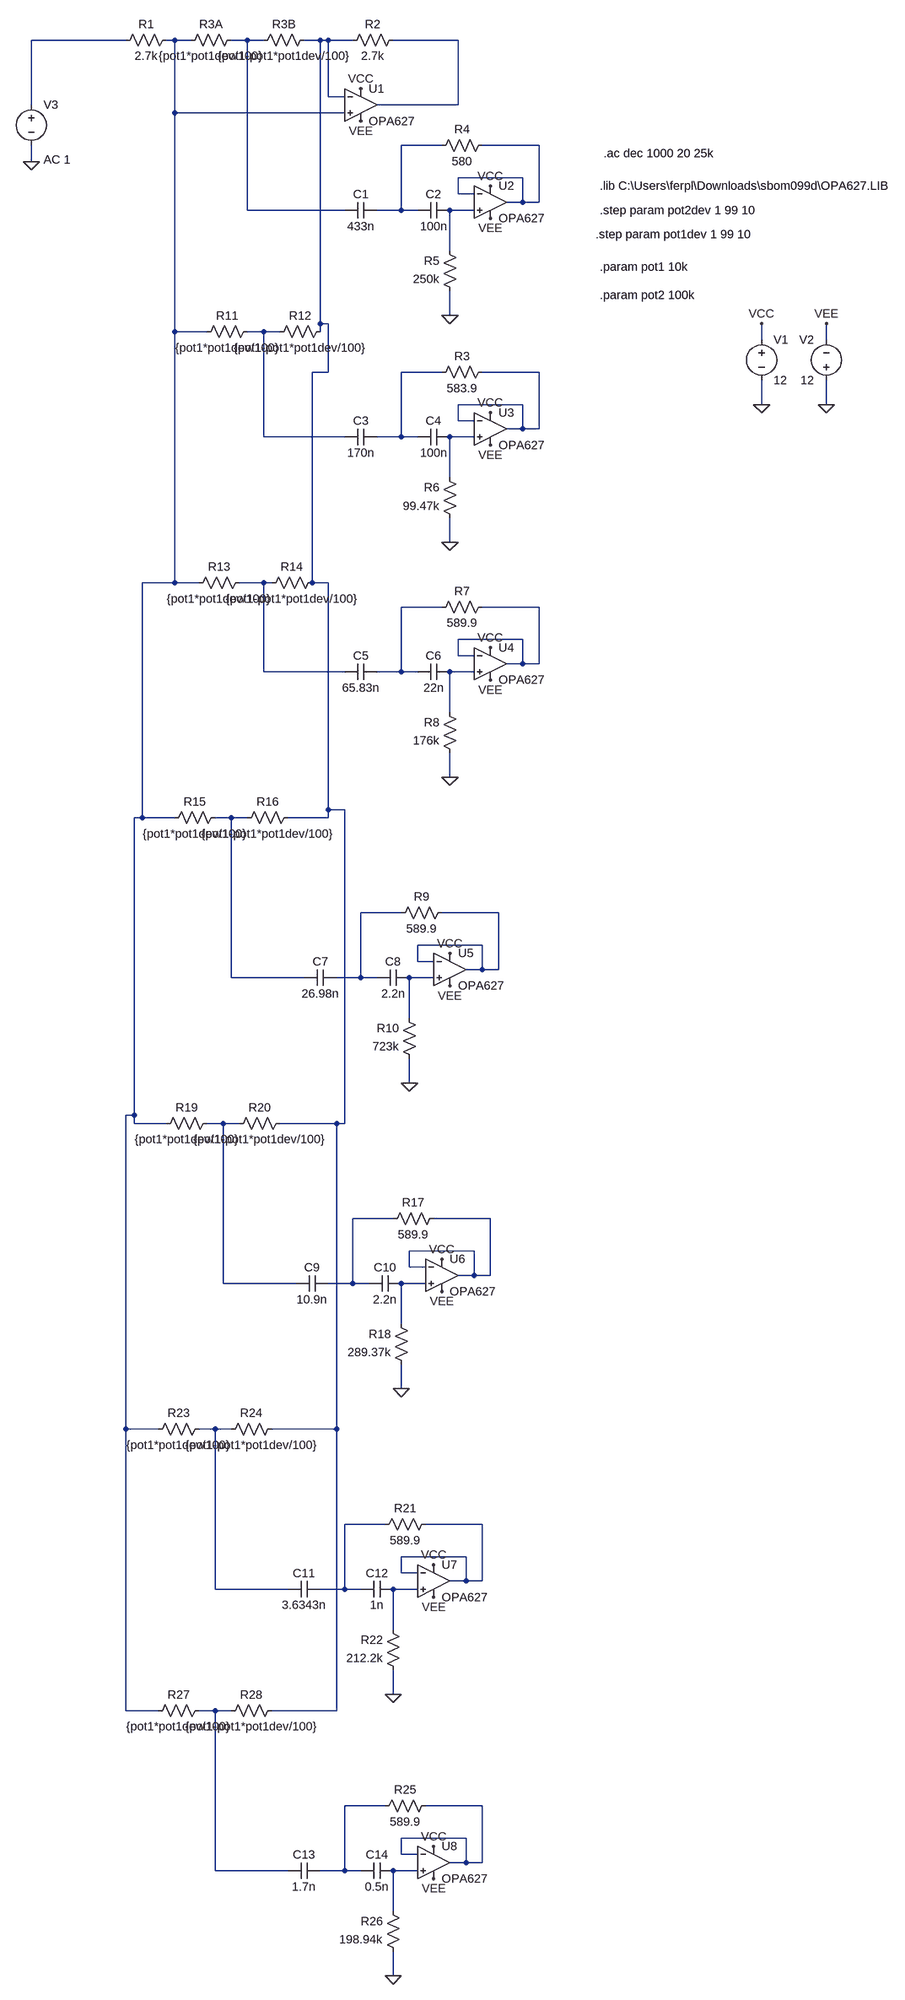
[diagram p0: schematic EQGraphic.asc]
EQGraphic.asc, the LTspice schematic file:
Version 4
SHEET 1 1188 3876
WIRE -832 -48 -1104 -48
WIRE -736 -48 -752 -48
WIRE -704 -48 -736 -48
WIRE -592 -48 -624 -48
WIRE -560 -48 -592 -48
WIRE -448 -48 -480 -48
WIRE -432 -48 -448 -48
WIRE -384 -48 -432 -48
WIRE -176 -48 -304 -48
WIRE -432 64 -432 -48
WIRE -400 64 -432 64
WIRE -1104 80 -1104 -48
WIRE -176 80 -176 -48
WIRE -176 80 -336 80
WIRE -736 96 -736 -48
WIRE -400 96 -736 96
WIRE -208 160 -288 160
WIRE -16 160 -128 160
WIRE -1104 192 -1104 160
WIRE -48 224 -176 224
WIRE -176 256 -176 224
WIRE -144 256 -176 256
WIRE -48 272 -48 224
WIRE -48 272 -80 272
WIRE -16 272 -16 160
WIRE -16 272 -48 272
WIRE -592 288 -592 -48
WIRE -400 288 -592 288
WIRE -288 288 -288 160
WIRE -288 288 -336 288
WIRE -256 288 -288 288
WIRE -144 288 -192 288
WIRE -192 368 -192 288
WIRE -192 496 -192 448
WIRE -448 512 -448 -48
WIRE -432 512 -448 512
WIRE -736 528 -736 96
WIRE -672 528 -736 528
WIRE -560 528 -592 528
WIRE -528 528 -560 528
WIRE -448 528 -448 512
WIRE 864 544 864 512
WIRE 992 544 992 512
WIRE -432 608 -432 512
WIRE -432 608 -464 608
WIRE -208 608 -288 608
WIRE -16 608 -128 608
WIRE -48 672 -176 672
WIRE 864 672 864 624
WIRE 992 672 992 624
WIRE -176 704 -176 672
WIRE -144 704 -176 704
WIRE -48 720 -48 672
WIRE -48 720 -80 720
WIRE -16 720 -16 608
WIRE -16 720 -48 720
WIRE -560 736 -560 528
WIRE -400 736 -560 736
WIRE -288 736 -288 608
WIRE -288 736 -336 736
WIRE -256 736 -288 736
WIRE -144 736 -192 736
WIRE -192 816 -192 736
WIRE -192 944 -192 896
WIRE -736 1024 -736 528
WIRE -736 1024 -800 1024
WIRE -688 1024 -736 1024
WIRE -560 1024 -608 1024
WIRE -544 1024 -560 1024
WIRE -464 1024 -464 608
WIRE -432 1024 -464 1024
WIRE -208 1072 -288 1072
WIRE -16 1072 -128 1072
WIRE -48 1136 -176 1136
WIRE -176 1168 -176 1136
WIRE -144 1168 -176 1168
WIRE -48 1184 -48 1136
WIRE -48 1184 -80 1184
WIRE -16 1184 -16 1072
WIRE -16 1184 -48 1184
WIRE -560 1200 -560 1024
WIRE -400 1200 -560 1200
WIRE -288 1200 -288 1072
WIRE -288 1200 -336 1200
WIRE -256 1200 -288 1200
WIRE -144 1200 -192 1200
WIRE -192 1280 -192 1200
WIRE -192 1408 -192 1360
WIRE -432 1472 -432 1024
WIRE -400 1472 -432 1472
WIRE -800 1488 -800 1024
WIRE -800 1488 -816 1488
WIRE -736 1488 -800 1488
WIRE -624 1488 -656 1488
WIRE -592 1488 -624 1488
WIRE -432 1488 -432 1472
WIRE -432 1488 -512 1488
WIRE -288 1696 -368 1696
WIRE -96 1696 -208 1696
WIRE -128 1760 -256 1760
WIRE -256 1792 -256 1760
WIRE -224 1792 -256 1792
WIRE -128 1808 -128 1760
WIRE -128 1808 -160 1808
WIRE -96 1808 -96 1696
WIRE -96 1808 -128 1808
WIRE -624 1824 -624 1488
WIRE -480 1824 -624 1824
WIRE -368 1824 -368 1696
WIRE -368 1824 -416 1824
WIRE -336 1824 -368 1824
WIRE -224 1824 -272 1824
WIRE -272 1904 -272 1824
WIRE -272 2032 -272 1984
WIRE -816 2096 -816 1488
WIRE -816 2096 -832 2096
WIRE -816 2112 -816 2096
WIRE -752 2112 -816 2112
WIRE -640 2112 -672 2112
WIRE -608 2112 -640 2112
WIRE -416 2112 -528 2112
WIRE -400 2112 -400 1472
WIRE -400 2112 -416 2112
WIRE -304 2320 -384 2320
WIRE -112 2320 -224 2320
WIRE -144 2384 -272 2384
WIRE -272 2416 -272 2384
WIRE -240 2416 -272 2416
WIRE -144 2432 -144 2384
WIRE -144 2432 -176 2432
WIRE -112 2432 -112 2320
WIRE -112 2432 -144 2432
WIRE -640 2448 -640 2112
WIRE -496 2448 -640 2448
WIRE -384 2448 -384 2320
WIRE -384 2448 -432 2448
WIRE -352 2448 -384 2448
WIRE -240 2448 -288 2448
WIRE -288 2528 -288 2448
WIRE -288 2656 -288 2608
WIRE -832 2736 -832 2096
WIRE -768 2736 -832 2736
WIRE -656 2736 -688 2736
WIRE -624 2736 -656 2736
WIRE -416 2736 -416 2112
WIRE -416 2736 -544 2736
WIRE -320 2944 -400 2944
WIRE -128 2944 -240 2944
WIRE -160 3008 -288 3008
WIRE -288 3040 -288 3008
WIRE -256 3040 -288 3040
WIRE -160 3056 -160 3008
WIRE -160 3056 -192 3056
WIRE -128 3056 -128 2944
WIRE -128 3056 -160 3056
WIRE -656 3072 -656 2736
WIRE -512 3072 -656 3072
WIRE -400 3072 -400 2944
WIRE -400 3072 -448 3072
WIRE -368 3072 -400 3072
WIRE -256 3072 -304 3072
WIRE -304 3152 -304 3072
WIRE -304 3280 -304 3232
WIRE -832 3312 -832 2736
WIRE -768 3312 -832 3312
WIRE -656 3312 -688 3312
WIRE -624 3312 -656 3312
WIRE -416 3312 -416 2736
WIRE -416 3312 -544 3312
WIRE -320 3520 -400 3520
WIRE -128 3520 -240 3520
WIRE -160 3584 -288 3584
WIRE -288 3616 -288 3584
WIRE -256 3616 -288 3616
WIRE -160 3632 -160 3584
WIRE -160 3632 -192 3632
WIRE -128 3632 -128 3520
WIRE -128 3632 -160 3632
WIRE -656 3648 -656 3312
WIRE -512 3648 -656 3648
WIRE -400 3648 -400 3520
WIRE -400 3648 -448 3648
WIRE -368 3648 -400 3648
WIRE -256 3648 -304 3648
WIRE -304 3728 -304 3648
WIRE -304 3856 -304 3808
FLAG 864 672 0
FLAG 992 672 0
FLAG 864 512 VCC
FLAG 992 512 VEE
FLAG -368 48 VCC
FLAG -368 112 VEE
FLAG -1104 192 0
FLAG -112 240 VCC
FLAG -112 304 VEE
FLAG -112 688 VCC
FLAG -112 752 VEE
FLAG -112 1152 VCC
FLAG -112 1216 VEE
FLAG -192 1408 0
FLAG -192 1776 VCC
FLAG -192 1840 VEE
FLAG -272 2032 0
FLAG -192 944 0
FLAG -192 496 0
FLAG -208 2400 VCC
FLAG -208 2464 VEE
FLAG -288 2656 0
FLAG -224 3024 VCC
FLAG -224 3088 VEE
FLAG -304 3280 0
FLAG -224 3600 VCC
FLAG -224 3664 VEE
FLAG -304 3856 0
SYMBOL voltage 864 528 R0
WINDOW 123 0 0 Left 0
WINDOW 39 0 0 Left 0
SYMATTR InstName V1
SYMATTR Value 12
SYMBOL voltage 992 640 R180
WINDOW 0 24 96 Left 2
WINDOW 3 24 16 Left 2
WINDOW 123 0 0 Left 0
WINDOW 39 0 0 Left 0
SYMATTR InstName V2
SYMATTR Value 12
SYMBOL OpAmps\\opamp2 -368 16 R0
SYMATTR InstName U1
SYMATTR Value OPA627
SYMBOL res -736 -64 R90
WINDOW 0 0 56 VBottom 2
WINDOW 3 32 56 VTop 2
SYMATTR InstName R1
SYMATTR Value 2.7k
SYMBOL res -608 -64 R90
WINDOW 0 0 56 VBottom 2
WINDOW 3 32 56 VTop 2
SYMATTR InstName R3A
SYMATTR Value {pot1*pot1dev/100}
SYMBOL res -464 -64 R90
WINDOW 0 0 56 VBottom 2
WINDOW 3 32 56 VTop 2
SYMATTR InstName R3B
SYMATTR Value {pot1-pot1*pot1dev/100}
SYMBOL res -288 -64 R90
WINDOW 0 0 56 VBottom 2
WINDOW 3 32 56 VTop 2
SYMATTR InstName R2
SYMATTR Value 2.7k
SYMBOL voltage -1104 64 R0
WINDOW 123 24 124 Left 2
WINDOW 39 0 0 Left 0
SYMATTR InstName V3
SYMATTR Value ""
SYMATTR Value2 AC 1
SYMBOL OpAmps\\opamp2 -112 208 R0
SYMATTR InstName U2
SYMATTR Value OPA627
SYMBOL cap -336 272 R90
WINDOW 0 0 32 VBottom 2
WINDOW 3 32 32 VTop 2
SYMATTR InstName C1
SYMATTR Value 433n
SYMBOL res -112 144 R90
WINDOW 0 0 56 VBottom 2
WINDOW 3 32 56 VTop 2
SYMATTR InstName R4
SYMATTR Value 580
SYMBOL res -176 464 R180
WINDOW 0 36 76 Left 2
WINDOW 3 36 40 Left 2
SYMATTR InstName R5
SYMATTR Value 250k
SYMBOL cap -192 272 R90
WINDOW 0 0 32 VBottom 2
WINDOW 3 32 32 VTop 2
SYMATTR InstName C2
SYMATTR Value 100n
SYMBOL OpAmps\\opamp2 -112 656 R0
SYMATTR InstName U3
SYMATTR Value OPA627
SYMBOL cap -336 720 R90
WINDOW 0 0 32 VBottom 2
WINDOW 3 32 32 VTop 2
SYMATTR InstName C3
SYMATTR Value 170n
SYMBOL res -112 592 R90
WINDOW 0 0 56 VBottom 2
WINDOW 3 32 56 VTop 2
SYMATTR InstName R3
SYMATTR Value 583.9
SYMBOL res -176 912 R180
WINDOW 0 36 76 Left 2
WINDOW 3 36 40 Left 2
SYMATTR InstName R6
SYMATTR Value 99.47k
SYMBOL cap -192 720 R90
WINDOW 0 0 32 VBottom 2
WINDOW 3 32 32 VTop 2
SYMATTR InstName C4
SYMATTR Value 100n
SYMBOL OpAmps\\opamp2 -112 1120 R0
SYMATTR InstName U4
SYMATTR Value OPA627
SYMBOL cap -336 1184 R90
WINDOW 0 0 32 VBottom 2
WINDOW 3 32 32 VTop 2
SYMATTR InstName C5
SYMATTR Value 65.83n
SYMBOL res -112 1056 R90
WINDOW 0 0 56 VBottom 2
WINDOW 3 32 56 VTop 2
SYMATTR InstName R7
SYMATTR Value 589.9
SYMBOL res -176 1376 R180
WINDOW 0 36 76 Left 2
WINDOW 3 36 40 Left 2
SYMATTR InstName R8
SYMATTR Value 176k
SYMBOL cap -192 1184 R90
WINDOW 0 0 32 VBottom 2
WINDOW 3 32 32 VTop 2
SYMATTR InstName C6
SYMATTR Value 22n
SYMBOL OpAmps\\opamp2 -192 1744 R0
SYMATTR InstName U5
SYMATTR Value OPA627
SYMBOL cap -416 1808 R90
WINDOW 0 0 32 VBottom 2
WINDOW 3 32 32 VTop 2
SYMATTR InstName C7
SYMATTR Value 26.98n
SYMBOL res -192 1680 R90
WINDOW 0 0 56 VBottom 2
WINDOW 3 32 56 VTop 2
SYMATTR InstName R9
SYMATTR Value 589.9
SYMBOL res -256 2000 R180
WINDOW 0 36 76 Left 2
WINDOW 3 36 40 Left 2
SYMATTR InstName R10
SYMATTR Value 723k
SYMBOL cap -272 1808 R90
WINDOW 0 0 32 VBottom 2
WINDOW 3 32 32 VTop 2
SYMATTR InstName C8
SYMATTR Value 2.2n
SYMBOL res -576 512 R90
WINDOW 0 0 56 VBottom 2
WINDOW 3 32 56 VTop 2
SYMATTR InstName R11
SYMATTR Value {pot1*pot1dev/100}
SYMBOL res -432 512 R90
WINDOW 0 0 56 VBottom 2
WINDOW 3 32 56 VTop 2
SYMATTR InstName R12
SYMATTR Value {pot1-pot1*pot1dev/100}
SYMBOL res -592 1008 R90
WINDOW 0 0 56 VBottom 2
WINDOW 3 32 56 VTop 2
SYMATTR InstName R13
SYMATTR Value {pot1*pot1dev/100}
SYMBOL res -448 1008 R90
WINDOW 0 0 56 VBottom 2
WINDOW 3 32 56 VTop 2
SYMATTR InstName R14
SYMATTR Value {pot1-pot1*pot1dev/100}
SYMBOL res -640 1472 R90
WINDOW 0 0 56 VBottom 2
WINDOW 3 32 56 VTop 2
SYMATTR InstName R15
SYMATTR Value {pot1*pot1dev/100}
SYMBOL res -496 1472 R90
WINDOW 0 0 56 VBottom 2
WINDOW 3 32 56 VTop 2
SYMATTR InstName R16
SYMATTR Value {pot1-pot1*pot1dev/100}
SYMBOL OpAmps\\opamp2 -208 2368 R0
SYMATTR InstName U6
SYMATTR Value OPA627
SYMBOL cap -432 2432 R90
WINDOW 0 0 32 VBottom 2
WINDOW 3 32 32 VTop 2
SYMATTR InstName C9
SYMATTR Value 10.9n
SYMBOL res -208 2304 R90
WINDOW 0 0 56 VBottom 2
WINDOW 3 32 56 VTop 2
SYMATTR InstName R17
SYMATTR Value 589.9
SYMBOL res -272 2624 R180
WINDOW 0 36 76 Left 2
WINDOW 3 36 40 Left 2
SYMATTR InstName R18
SYMATTR Value 289.37k
SYMBOL cap -288 2432 R90
WINDOW 0 0 32 VBottom 2
WINDOW 3 32 32 VTop 2
SYMATTR InstName C10
SYMATTR Value 2.2n
SYMBOL res -656 2096 R90
WINDOW 0 0 56 VBottom 2
WINDOW 3 32 56 VTop 2
SYMATTR InstName R19
SYMATTR Value {pot1*pot1dev/100}
SYMBOL res -512 2096 R90
WINDOW 0 0 56 VBottom 2
WINDOW 3 32 56 VTop 2
SYMATTR InstName R20
SYMATTR Value {pot1-pot1*pot1dev/100}
SYMBOL OpAmps\\opamp2 -224 2992 R0
SYMATTR InstName U7
SYMATTR Value OPA627
SYMBOL cap -448 3056 R90
WINDOW 0 0 32 VBottom 2
WINDOW 3 32 32 VTop 2
SYMATTR InstName C11
SYMATTR Value 3.6343n
SYMBOL res -224 2928 R90
WINDOW 0 0 56 VBottom 2
WINDOW 3 32 56 VTop 2
SYMATTR InstName R21
SYMATTR Value 589.9
SYMBOL res -288 3248 R180
WINDOW 0 36 76 Left 2
WINDOW 3 36 40 Left 2
SYMATTR InstName R22
SYMATTR Value 212.2k
SYMBOL cap -304 3056 R90
WINDOW 0 0 32 VBottom 2
WINDOW 3 32 32 VTop 2
SYMATTR InstName C12
SYMATTR Value 1n
SYMBOL res -672 2720 R90
WINDOW 0 0 56 VBottom 2
WINDOW 3 32 56 VTop 2
SYMATTR InstName R23
SYMATTR Value {pot1*pot1dev/100}
SYMBOL res -528 2720 R90
WINDOW 0 0 56 VBottom 2
WINDOW 3 32 56 VTop 2
SYMATTR InstName R24
SYMATTR Value {pot1-pot1*pot1dev/100}
SYMBOL OpAmps\\opamp2 -224 3568 R0
SYMATTR InstName U8
SYMATTR Value OPA627
SYMBOL cap -448 3632 R90
WINDOW 0 0 32 VBottom 2
WINDOW 3 32 32 VTop 2
SYMATTR InstName C13
SYMATTR Value 1.7n
SYMBOL res -224 3504 R90
WINDOW 0 0 56 VBottom 2
WINDOW 3 32 56 VTop 2
SYMATTR InstName R25
SYMATTR Value 589.9
SYMBOL res -288 3824 R180
WINDOW 0 36 76 Left 2
WINDOW 3 36 40 Left 2
SYMATTR InstName R26
SYMATTR Value 198.94k
SYMBOL cap -304 3632 R90
WINDOW 0 0 32 VBottom 2
WINDOW 3 32 32 VTop 2
SYMATTR InstName C14
SYMATTR Value 0.5n
SYMBOL res -672 3296 R90
WINDOW 0 0 56 VBottom 2
WINDOW 3 32 56 VTop 2
SYMATTR InstName R27
SYMATTR Value {pot1*pot1dev/100}
SYMBOL res -528 3296 R90
WINDOW 0 0 56 VBottom 2
WINDOW 3 32 56 VTop 2
SYMATTR InstName R28
SYMATTR Value {pot1-pot1*pot1dev/100}
TEXT 544 240 Left 2 !.lib C:\\Users\\ferpl\\Downloads\\sbom099d\\OPA627.LIB
TEXT 552 176 Left 2 !.ac dec 1000 20 25k
TEXT 544 288 Left 2 !.step param pot2dev 1 99 10
TEXT 536 336 Left 2 !.step param pot1dev 1 99 10
TEXT 544 400 Left 2 !.param pot1 10k
TEXT 544 456 Left 2 !.param pot2 100k

The netlist it stands for:
* EQGraphic.asc
V1 VCC 0 12
V2 0 VEE 12
XU1 N002 N004 VCC VEE N005 OPA627  ; pins In+ In- V+ V- OUT
R1 N002 N001 2.7k
R3A N003 N002 {pot1*pot1dev/100}
R3B N004 N003 {pot1-pot1*pot1dev/100}
R2 N005 N004 2.7k
V3 N001 0 AC 1
XU2 N008 N007 VCC VEE N007 OPA627  ; pins In+ In- V+ V- OUT
C1 N006 N003 433n
R4 N007 N006 580
R5 0 N008 250k
C2 N008 N006 100n
XU3 N012 N011 VCC VEE N011 OPA627  ; pins In+ In- V+ V- OUT
C3 N010 N009 170n
R3 N011 N010 583.9
R6 0 N012 99.47k
C4 N012 N010 100n
XU4 N016 N015 VCC VEE N015 OPA627  ; pins In+ In- V+ V- OUT
C5 N014 N013 65.83n
R7 N015 N014 589.9
R8 0 N016 176k
C6 N016 N014 22n
XU5 N020 N019 VCC VEE N019 OPA627  ; pins In+ In- V+ V- OUT
C7 N018 N017 26.98n
R9 N019 N018 589.9
R10 0 N020 723k
C8 N020 N018 2.2n
R11 N009 N002 {pot1*pot1dev/100}
R12 N004 N009 {pot1-pot1*pot1dev/100}
R13 N013 N002 {pot1*pot1dev/100}
R14 N004 N013 {pot1-pot1*pot1dev/100}
R15 N017 N002 {pot1*pot1dev/100}
R16 N004 N017 {pot1-pot1*pot1dev/100}
XU6 N024 N023 VCC VEE N023 OPA627  ; pins In+ In- V+ V- OUT
C9 N022 N021 10.9n
R17 N023 N022 589.9
R18 0 N024 289.37k
C10 N024 N022 2.2n
R19 N021 N002 {pot1*pot1dev/100}
R20 N004 N021 {pot1-pot1*pot1dev/100}
XU7 N028 N027 VCC VEE N027 OPA627  ; pins In+ In- V+ V- OUT
C11 N026 N025 3.6343n
R21 N027 N026 589.9
R22 0 N028 212.2k
C12 N028 N026 1n
R23 N025 N002 {pot1*pot1dev/100}
R24 N004 N025 {pot1-pot1*pot1dev/100}
XU8 N032 N031 VCC VEE N031 OPA627  ; pins In+ In- V+ V- OUT
C13 N030 N029 1.7n
R25 N031 N030 589.9
R26 0 N032 198.94k
C14 N032 N030 0.5n
R27 N029 N002 {pot1*pot1dev/100}
R28 N004 N029 {pot1-pot1*pot1dev/100}
.lib C:\Users\ferpl\Downloads\sbom099d\OPA627.LIB
.ac dec 1000 20 25k
.step param pot2dev 1 99 10
.step param pot1dev 1 99 10
.param pot1 10k
.param pot2 100k
.backanno
.end